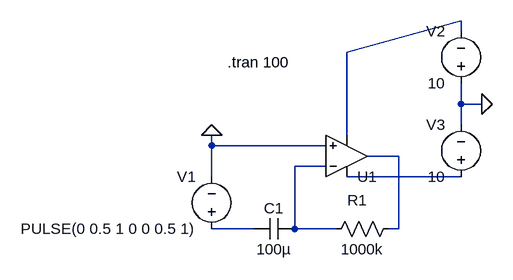
[diagram p0: schematic non_invert_amp.asc]
non_invert_amp.asc, the LTspice schematic file:
Version 4
SHEET 1 880 680
WIRE 576 32 576 16
WIRE 400 64 576 16
WIRE 576 144 576 112
WIRE 608 144 576 144
WIRE 576 176 576 144
WIRE 400 192 400 64
WIRE 192 208 192 192
WIRE 368 208 192 208
WIRE 480 224 432 224
WIRE 368 240 320 240
WIRE 192 256 192 208
WIRE 576 256 400 256
WIRE 256 336 192 336
WIRE 320 336 320 240
WIRE 384 336 320 336
WIRE 480 336 480 224
WIRE 480 336 464 336
FLAG 192 192 0
FLAG 608 144 0
SYMBOL UniversalOpamp2 400 224 M180
SYMATTR InstName U1
SYMBOL voltage 192 352 R180
WINDOW 0 24 96 Left 2
WINDOW 3 24 16 Left 2
SYMATTR InstName V1
SYMATTR Value PULSE(0 0.5 1 0 0 0.5 1)
SYMBOL res 480 320 R90
WINDOW 0 -12 64 VBottom 2
WINDOW 3 32 56 VTop 2
SYMATTR InstName R1
SYMATTR Value 1000k
SYMBOL voltage 576 272 R180
WINDOW 0 24 96 Left 2
WINDOW 3 24 16 Left 2
SYMATTR InstName V3
SYMATTR Value 10
SYMBOL voltage 576 128 R180
WINDOW 0 24 96 Left 2
WINDOW 3 24 16 Left 2
SYMATTR InstName V2
SYMATTR Value 10
SYMBOL cap 320 320 R90
WINDOW 0 0 32 VBottom 2
WINDOW 3 32 32 VTop 2
SYMATTR InstName C1
SYMATTR Value 100µ
TEXT 216 80 Left 2 !.tran 100

The netlist it stands for:
* non_invert_amp.asc
XU1 0 N003 N004 N001 N002 level.2 Avol=1Meg GBW=10Meg Slew=10Meg ilimit=25m rail=0 Vos=0 phimargin=45 en=0 enk=0 in=0 ink=0 Rin=500Meg  ; pins IN+ IN- V+ V- OUT
V1 N005 0 PULSE(0 0.5 1 0 0 0.5 1)
R1 N002 N003 1000k
V3 N004 0 10
V2 0 N001 10
C1 N003 N005 100µ
.tran 100
.lib UniversalOpamps2.sub
.backanno
.end